# EAGLE board controller-r3 (EAGLE 6.6.0)
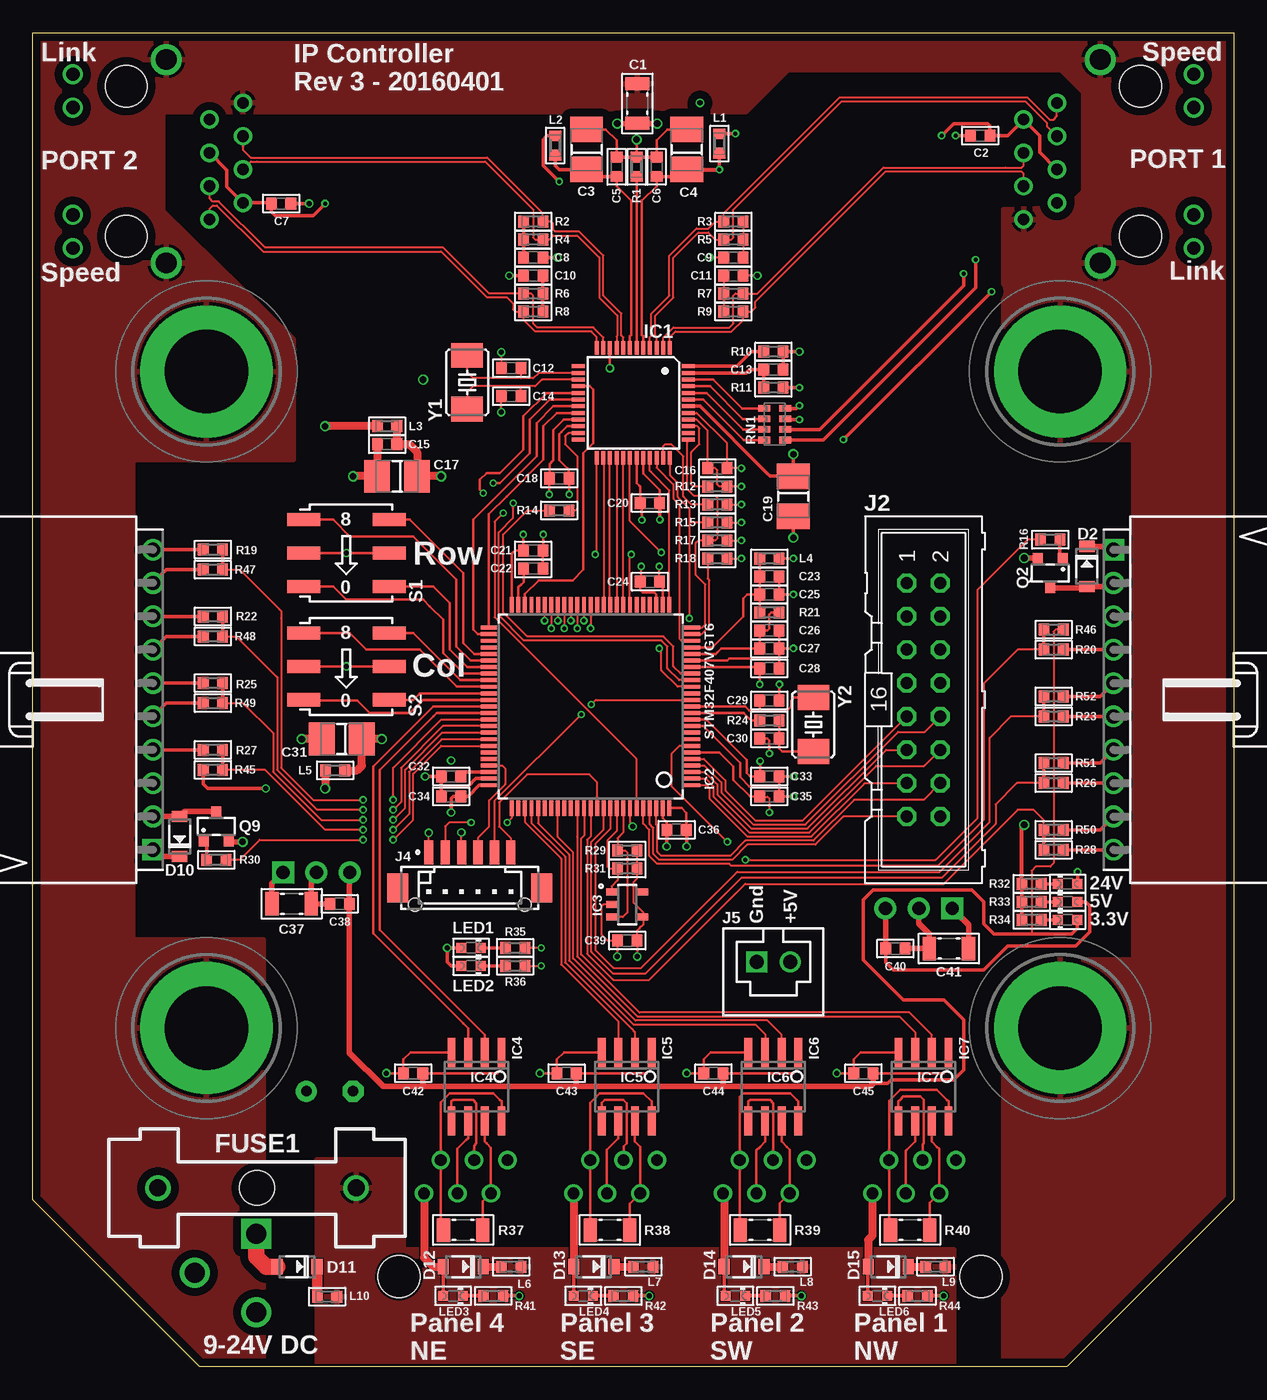
[diagram p3: board, top side]
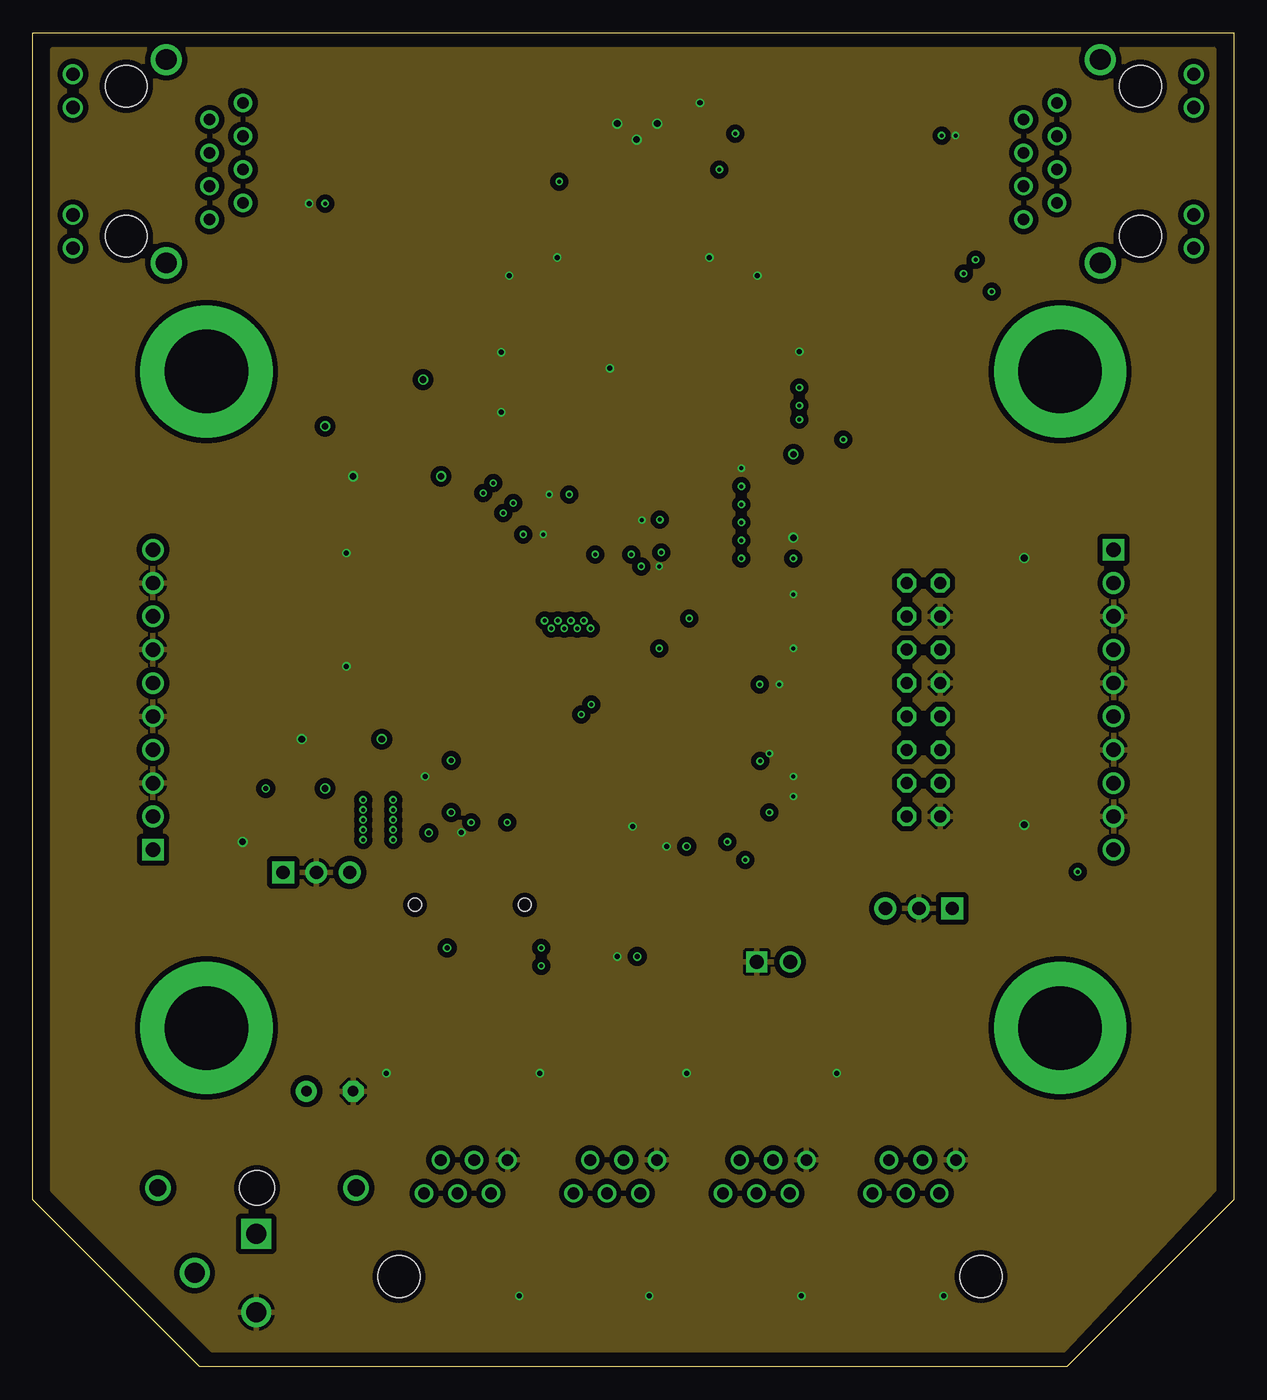
[diagram p4: board, inner layer Route2]
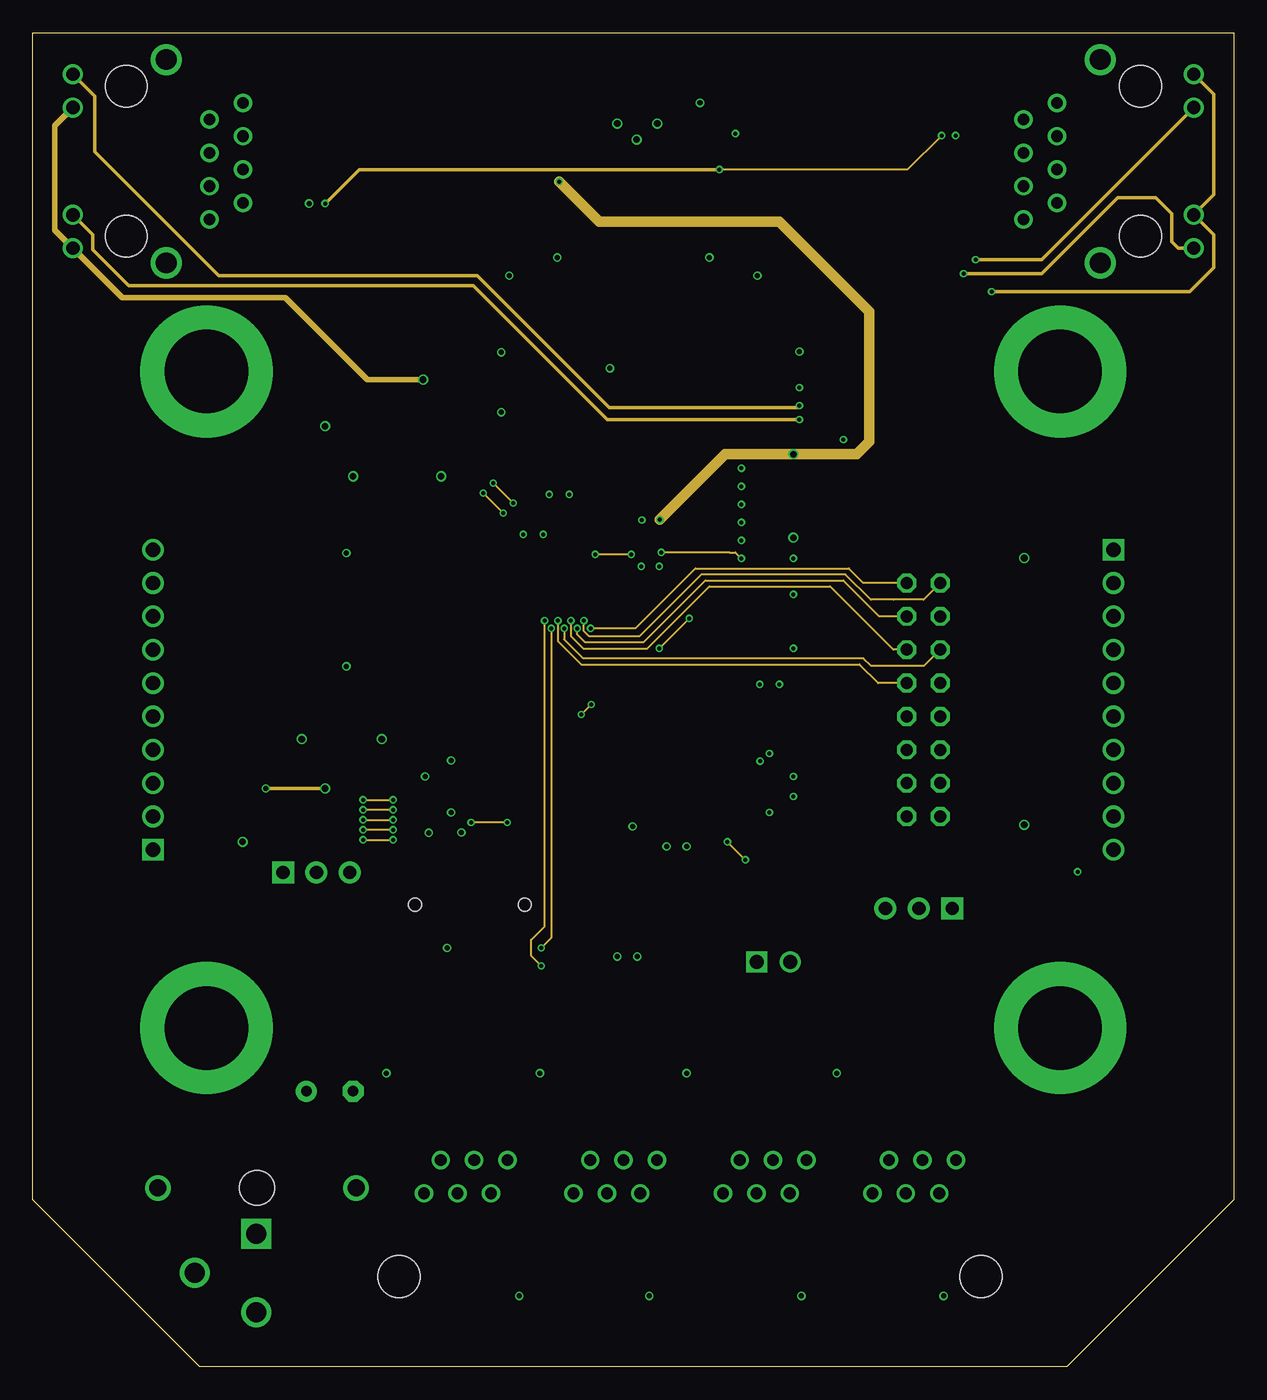
[diagram p5: board, inner layer Route3]
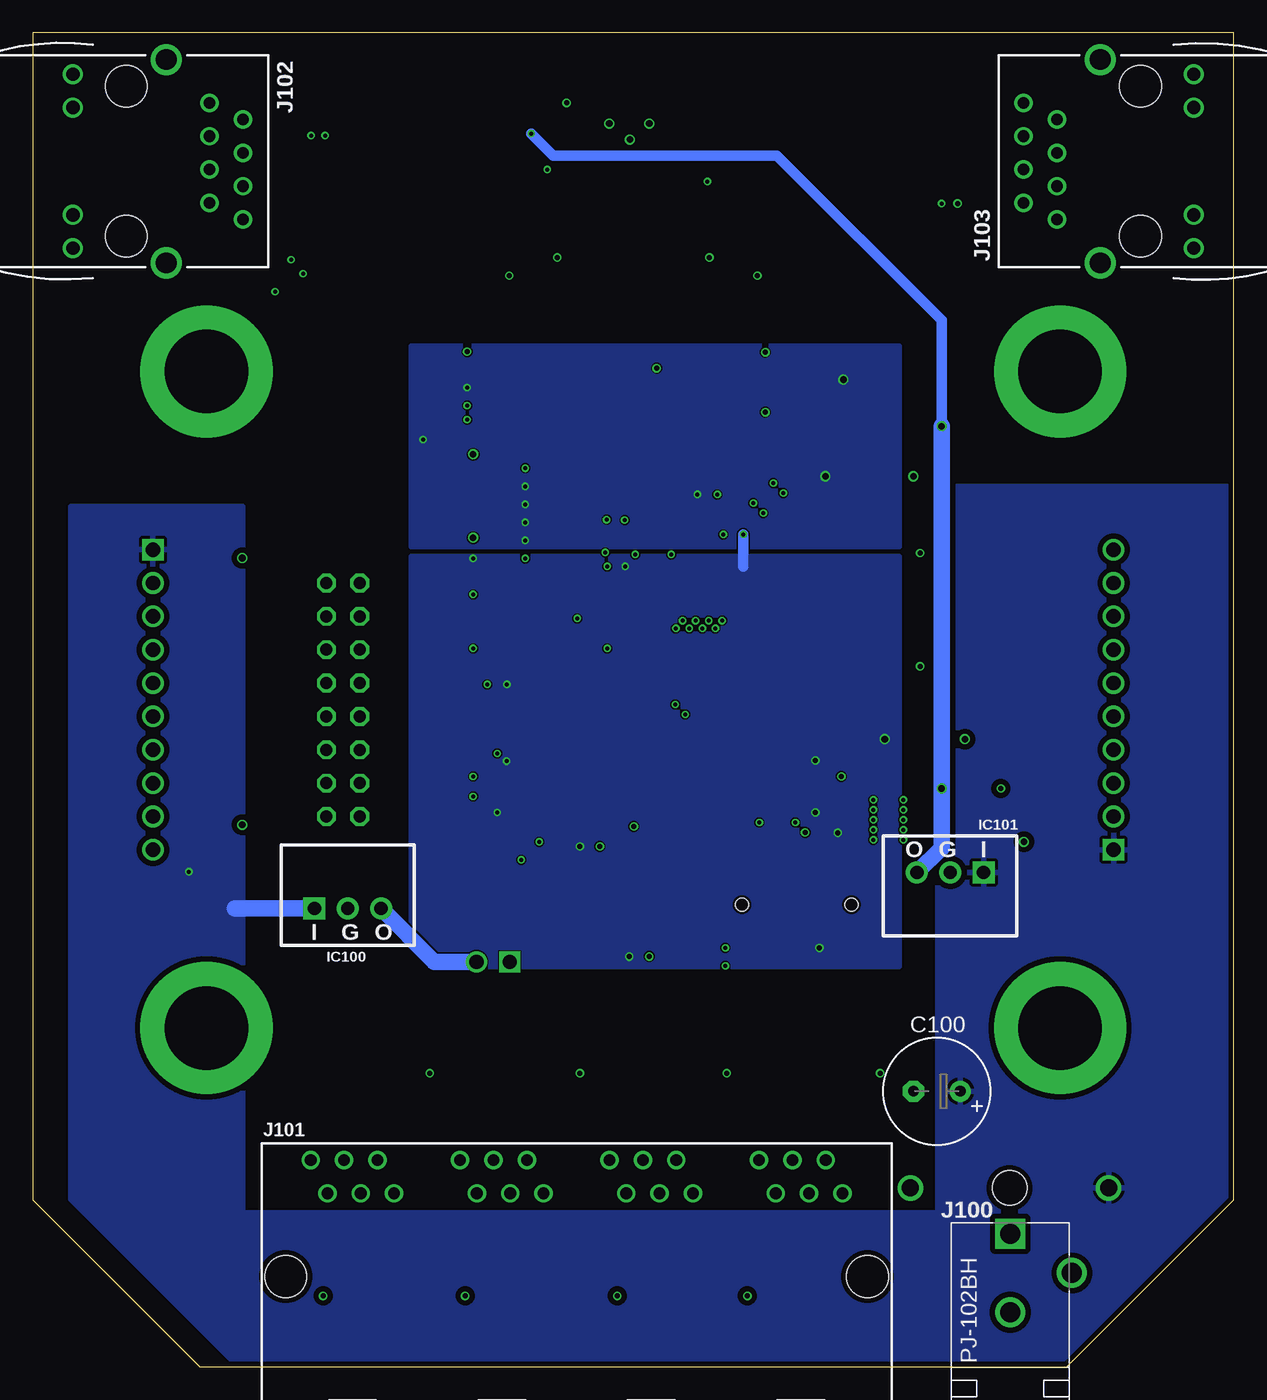
[diagram p6: board, bottom side, seen from below]

Size 91.44 x 101.6 mm. Coordinates in mm from the lower left corner, seen from the top.
Outline: 78.74,0 12.7,0 0,12.7 0,101.6 91.44,101.6 91.44,12.7 78.74,0
Copper layers (1+2*3+16): Top 0.042mm / dielectric 0.2mm / Route2 0.035mm / dielectric 1.1mm / Route3 0.035mm / dielectric 0.2mm / Bottom 0.042mm
Design rules "quickturnpcb.co.kr_4L": minimum track width 4mil, minimum drill 12mil, track to track 4mil, track to pad 4mil, pad to pad 4mil, via to via 4mil, smd to smd 0mil, copper to edge 8mil, drill to drill 8mil, minimum pad ring 10mil, minimum via ring 5mil, stop-mask expansion 2mil, vias tented up to drill 20mil, thermal gap 10mil
Net classes: 1 Earth: clearance 0.406 mm

## Footprints (pad centres in the part's own frame; a part is rotated, then mirrored left to right if it is on the bottom)
C1206B = smd 1 x 1.8: 1 -1.5,0; 2 1.5,0
C0603B = smd 0.813 x 0.914: 1 -0.737,0; 2 0.737,0
B/3528-21R = smd 1.95 x 2.5: + 1.525,0; - -1.525,0
E3,5-8 = drill 0.813 pad 1.6: + -1.778,0 | drill 0.813 pad 1.6 octagon: - 1.778,0
SOD-123 = smd 0.85 x 1.2: A 1.525,0; C -1.525,0
649 = drill 1.295: 1 -7.544,0; 2 7.544,0 | hole 2.642: 0,0
TQFP48 = smd 1.016 x 0.305: 1 -4.191,2.794; 2 -4.191,2.286; 3 -4.191,1.778; 4 -4.191,1.27; 5 -4.191,0.762; 6 -4.191,0.254; 7 -4.191,-0.254; 8 -4.191,-0.762; 9 -4.191,-1.27; 10 -4.191,-1.778; 11 -4.191,-2.286; 12 -4.191,-2.794; 25 4.191,-2.794; 26 4.191,-2.286; 27 4.191,-1.778; 28 4.191,-1.27; 29 4.191,-0.762; 30 4.191,-0.254; 31 4.191,0.254; 32 4.191,0.762; 33 4.191,1.27; 34 4.191,1.778; 35 4.191,2.286; 36 4.191,2.794 | smd 0.305 x 1.016: 13 -2.794,-4.191; 14 -2.286,-4.191; 15 -1.778,-4.191; 16 -1.27,-4.191; 17 -0.762,-4.191; 18 -0.254,-4.191; 19 0.254,-4.191; 20 0.762,-4.191; 21 1.27,-4.191; 22 1.778,-4.191; 23 2.286,-4.191; 24 2.794,-4.191; 37 2.794,4.191; 38 2.286,4.191; 39 1.778,4.191; 40 1.27,4.191; 41 0.762,4.191; 42 0.254,4.191; 43 -0.254,4.191; 44 -0.762,4.191; 45 -1.27,4.191; 46 -1.778,4.191; 47 -2.286,4.191; 48 -2.794,4.191
LQFP-100 = smd 0.3 x 1.2: 1 -6,-7.75; 2 -5.5,-7.75; 3 -5,-7.75; 4 -4.5,-7.75; 5 -4,-7.75; 6 -3.5,-7.75; 7 -3,-7.75; 8 -2.5,-7.75; 9 -2,-7.75; 10 -1.5,-7.75; 11 -1,-7.75; 12 -0.5,-7.75; 13 0,-7.75; 14 0.5,-7.75; 15 1,-7.75; 16 1.5,-7.75; 17 2,-7.75; 18 2.5,-7.75; 19 3,-7.75; 20 3.5,-7.75; 21 4,-7.75; 22 4.5,-7.75; 23 5,-7.75; 24 5.5,-7.75; 25 6,-7.75; 51 6,7.75; 52 5.5,7.75; 53 5,7.75; 54 4.5,7.75; 55 4,7.75; 56 3.5,7.75; 57 3,7.75; 58 2.5,7.75; 59 2,7.75; 60 1.5,7.75; 61 1,7.75; 62 0.5,7.75; 63 0,7.75; 64 -0.5,7.75; 65 -1,7.75; 66 -1.5,7.75; 67 -2,7.75; 68 -2.5,7.75; 69 -3,7.75; 70 -3.5,7.75; 71 -4,7.75; 72 -4.5,7.75; 73 -5,7.75; 74 -5.5,7.75; 75 -6,7.75 | smd 1.2 x 0.3: 26 7.75,-6; 27 7.75,-5.5; 28 7.75,-5; 29 7.75,-4.5; 30 7.75,-4; 31 7.75,-3.5; 32 7.75,-3; 33 7.75,-2.5; 34 7.75,-2; 35 7.75,-1.5; 36 7.75,-1; 37 7.75,-0.5; 38 7.75,0; 39 7.75,0.5; 40 7.75,1; 41 7.75,1.5; 42 7.75,2; 43 7.75,2.5; 44 7.75,3; 45 7.75,3.5; 46 7.75,4; 47 7.75,4.5; 48 7.75,5; 49 7.75,5.5; 50 7.75,6; 76 -7.75,6; 77 -7.75,5.5; 78 -7.75,5; 79 -7.75,4.5; 80 -7.75,4; 81 -7.75,3.5; 82 -7.75,3; 83 -7.75,2.5; 84 -7.75,2; 85 -7.75,1.5; 86 -7.75,1; 87 -7.75,0.5; 88 -7.75,0; 89 -7.75,-0.5; 90 -7.75,-1; 91 -7.75,-1.5; 92 -7.75,-2; 93 -7.75,-2.5; 94 -7.75,-3; 95 -7.75,-3.5; 96 -7.75,-4; 97 -7.75,-4.5; 98 -7.75,-5; 99 -7.75,-5.5; 100 -7.75,-6
SOT-23-5 = smd 0.55 x 0.8: 1 -0.95,-1.2; 2 0,-1.2; 3 0.95,-1.2; 4 0.95,1.2; 5 -0.95,1.2
SO08 = smd 0.6 x 2.2: 1 -1.905,-2.6; 2 -0.635,-2.6; 3 0.635,-2.6; 4 1.905,-2.6; 5 1.905,2.6; 6 0.635,2.6; 7 -0.635,2.6; 8 -1.905,2.6
OKI-78SR-V = drill 1.016 pad 1.676: GND 0,0; OUT 2.54,0 | drill 1.016 pad 1.676 square: IN -2.54,0
MOLEX_70553-(10) = drill 1.092 square: 1 11.43,0 | drill 1.092: 2 8.89,0; 3 6.35,0; 4 3.81,0; 5 1.27,0; 6 -1.27,0; 7 -3.81,0; 8 -6.35,0; 9 -8.89,0; 10 -11.43,0
ML16 = drill 0.914 octagon: 1 -8.89,-1.27; 2 -8.89,1.27; 3 -6.35,-1.27; 4 -6.35,1.27; 5 -3.81,-1.27; 6 -3.81,1.27; 7 -1.27,-1.27; 8 -1.27,1.27; 9 1.27,-1.27; 10 1.27,1.27; 11 3.81,-1.27; 12 3.81,1.27; 13 6.35,-1.27; 14 6.35,1.27; 15 8.89,-1.27; 16 8.89,1.27
DF13-6P-1.25V = smd 0.7 x 1.8: 1 -3.125,2.7; 2 -1.875,2.7; 3 -0.625,2.7; 4 0.625,2.7; 5 1.875,2.7; 6 3.125,2.7 | smd 1.6 x 2.2: T1 5.475,0; T2 -5.475,0 | hole 1: 4.18,-1.3; -4.18,-1.3
MOLEX_70543-0001 = drill 1.067 square: 1 -1.27,0 | drill 1.067: 2 1.27,0
PJ-102(DC_JACK) = drill 1.524 square: 1 0,13.691 | drill 1.524: 2 0,7.696; 3 4.699,10.693
SS-666604-NF = drill 0.889: A1 -20.244,8.89; A2 -18.974,6.35; A3 -17.704,8.89; A4 -16.434,6.35; A5 -15.164,8.89; A6 -13.894,6.35; B1 -8.865,8.89; B2 -7.595,6.35; B3 -6.325,8.89; B4 -5.055,6.35; B5 -3.785,8.89; B6 -2.515,6.35; C1 2.515,8.89; C2 3.785,6.35; C3 5.055,8.89; C4 6.325,6.35; C5 7.595,8.89; C6 8.865,6.35; D1 13.894,8.89; D2 15.164,6.35; D3 16.434,8.89; D4 17.704,6.35; D5 18.974,8.89; D6 20.244,6.35 | hole 3.2: -22.149,0; 22.149,0
SI-60062-F = drill 0.889: 1 -4.445,6.35; 2 -3.175,8.89; 3 -1.905,6.35; 4 -0.635,8.89; 5 0.635,6.35; 6 1.905,8.89; 7 3.175,6.35; 8 4.445,8.89 | drill 1.016: GA 4.089,-4.064; GC 6.629,-4.064; YA -6.629,-4.064; YC -4.089,-4.064 | drill 1.575: P$1 -7.747,3.048; P$2 7.747,3.048 | hole 3.2: -5.715,0; 5.715,0
R0603B = smd 0.813 x 0.914: 1 -0.737,0; 2 0.737,0
CHIPLED_0603 = smd 0.762 x 0.762: A 0,-0.737; C 0,0.737
SOT-23 = smd 0.762 x 0.762: 1 -1.143,0.953; 2 -1.143,-0.953; 3 1.143,0
R1206B = smd 1 x 1.8: 1 -1.5,0; 2 1.5,0
CTS_742-4 = smd 0.9 x 0.5: A1 -0.8,1.2; A2 0.8,1.2; B1 -0.8,0.4; B2 0.8,0.4; C1 -0.8,-0.4; C2 0.8,-0.4; D1 -0.8,-1.2; D2 0.8,-1.2
SH-7050TA = smd 2.5 x 1: 1 -3.25,2.54; 2 3.25,-2.54; 4 -3.25,-2.54; 8 3.25,2.54; C -3.25,0; C@2 3.25,0
SMTPR-6-1 = drill 6.35 pad 10.058: P$1 0,0
5X3.2 = smd 1.9 x 2.4: 1 -2.05,0; 2 2.05,0

## Placement (x,y rotation side)
C1  1000pF 2kV  [C1206B]  46.02,96.22 90 top
C2  10uF  [C0603B]  72.14,93.78 180 top
C3  22uF  [B/3528-21R]  42.16,92.71 270 top
C4  22uF  [B/3528-21R]  49.78,92.71 270 top
C5  .1uF  [C0603B]  44.45,91.39 270 top
C6  .1uF  [C0603B]  47.5,91.39 270 top
C7  10uF  [C0603B]  18.9,88.6 180 top
C8  .1uF  [C0603B]  38.1,84.48 0 top
C9  .1uF  [C0603B]  53.34,84.48 180 top
C10  .1uF  [C0603B]  38.1,83.11 0 top
C11  .1uF  [C0603B]  53.34,83.11 180 top
C12  18pF  [C0603B]  36.42,76.05 0 top
C13  10uF  [C0603B]  56.39,75.95 180 top
C14  18pF  [C0603B]  36.42,73.91 0 top
C15  .1uF  [C0603B]  26.97,70.26 0 top
C16  .1uF  [C0603B]  52.12,68.43 180 top
C17  22uF  [B/3528-21R]  27.74,67.82 0 top
C18  .1uF  [C0603B]  40.08,67.67 180 top
C19  22uF  [B/3528-21R]  57.91,66.29 90 top
C20  .1uF  [C0603B]  46.99,65.79 180 top
C21  .1uF  [C0603B]  38.1,62.18 180 top
C22  2.2uF  [C0603B]  38.1,60.81 180 top
C23  1uF  [C0603B]  56.08,60.2 0 top
C24  .1uF  [C0603B]  46.99,59.79 180 top
C25  .1uF  [C0603B]  56.08,58.83 0 top
C26  1uF  [C0603B]  56.08,56.08 0 top
C27  .1uF  [C0603B]  56.08,54.71 0 top
C28  .1uF  [C0603B]  56.08,53.19 0 top
C29  5pF  [C0603B]  56.08,50.75 180 top
C30  5pF  [C0603B]  56.08,47.85 180 top
C31  22uF  [B/3528-21R]  23.52,47.8 0 top
C32  2.2uF  [C0603B]  31.85,44.96 180 top
C33  .1uF  [C0603B]  56.08,44.96 0 top
C34  .1uF  [C0603B]  31.85,43.43 180 top
C35  .1uF  [C0603B]  56.08,43.43 0 top
C36  .1uF  [C0603B]  49.02,40.89 0 top
C37  10uF 50v  [C1206B]  19.71,35.26 0 top
C38  10uF  [C0603B]  23.37,35.26 0 top
C39  .1uF  [C0603B]  45.26,32.46 180 top
C40  10uF  [C0603B]  65.68,31.85 180 top
C41  10uF 50v  [C1206B]  69.75,31.85 180 top
C42  .1uF  [C0603B]  28.96,22.35 0 top
C43  .1uF  [C0603B]  40.64,22.35 0 top
C44  .1uF  [C0603B]  51.82,22.35 0 top
C45  .1uF  [C0603B]  63.25,22.35 0 top
C100  100uF  [E3,5-8]  22.61,20.98 180 bottom
D2  CDBM140-G  [SOD-123]  80.26,60.96 270 top
D10  CDBM140-G  [SOD-123]  11.18,40.39 90 top
D11  CDBM140-G  [SOD-123]  20.12,7.62 180 top
D12  CDBM140-G  [SOD-123]  32.77,7.62 180 top
D13  CDBM140-G  [SOD-123]  42.72,7.62 180 top
D14  CDBM140-G  [SOD-123]  54.15,7.62 180 top
D15  CDBM140-G  [SOD-123]  65.13,7.62 180 top
FUSE1  5x20  [649]  17.07,13.61 180 top
IC1  KSZ8863MLLI  [TQFP48]  45.72,73.41 270 top
IC2  STM32F407VGT6  [LQFP-100]  42.47,50.29 90 top
IC3  24AA02E48T-I/OT  [SOT-23-5]  45.26,35.2 270 top
IC4  LTC2863  [SO08]  33.78,21.34 180 top
IC5  LTC2863  [SO08]  45.21,21.34 180 top
IC6  LTC2863  [SO08]  56.39,21.34 180 top
IC7  LTC2863  [SO08]  67.82,21.34 180 top
IC100  OKI-78SR-5/1.5-W36-C  [OKI-78SR-V]  67.46,34.9 0 bottom
IC101  OKI-78SR-3.3/1.5-W36-C  [OKI-78SR-V]  21.59,37.64 180 bottom
J1  10X1_70553-0009  [MOLEX_70553-(10)]  9.14,50.8 270 top
J2  2x8 header  [ML16]  67.82,50.8 270 top
J3  10X1_70553-0009  [MOLEX_70553-(10)]  82.3,50.8 90 top
J4  STM32-SW-DF13V  [DF13-6P-1.25V]  33.27,36.47 0 top
J5  1X2_70543  [MOLEX_70543-0001]  56.39,30.84 0 top
J100  PJ-102AH  [PJ-102(DC_JACK)]  17.02,-3.56 0 bottom
J101  RJ12-QUAD  [SS-666604-NF]  50.04,6.86 0 bottom
J102  MAGJACK-SI-60062-F  [SI-60062-F]  84.33,91.82 270 bottom
J103  MAGJACK-SI-60062-F  [SI-60062-F]  7.11,91.82 90 bottom
L1  100R  [R0603B]  52.27,93.17 270 top
L2  100R  [R0603B]  39.78,93.01 90 top
L3  100R  [R0603B]  26.97,71.63 0 top
L4  100R  [R0603B]  56.08,61.57 0 top
L5  100R  [R0603B]  23.01,45.42 0 top
L6  1000 Ohm  [R0603B]  36.42,7.62 180 top
L7  1000 Ohm  [R0603B]  46.48,7.62 180 top
L8  1000 Ohm  [R0603B]  57.86,7.62 180 top
L9  1000 Ohm  [R0603B]  68.73,7.62 180 top
L10  1000 Ohm  [R0603B]  22.4,5.33 180 top
LED1  green  [CHIPLED_0603]  33.38,31.9 270 top
LED2  red  [CHIPLED_0603]  33.38,30.53 270 top
LED3  green  [CHIPLED_0603]  32,5.38 270 top
LED4  green  [CHIPLED_0603]  41.91,5.38 270 top
LED5  green  [CHIPLED_0603]  53.49,5.38 270 top
LED6  green  [CHIPLED_0603]  64.31,5.38 270 top
POWER  green  [CHIPLED_0603]  78.79,36.78 90 top
POWER1  green  [CHIPLED_0603]  78.79,35.41 90 top
POWER2  green  [CHIPLED_0603]  78.79,34.04 90 top
Q2  NFET-IRLML0060-SOT23  [SOT-23]  77.47,60.45 270 top
Q9  NFET-IRLML0060-SOT23  [SOT-23]  13.97,41.15 90 top
R1  12k1  [R0603B]  45.97,91.39 90 top
R2  49R9  [R0603B]  38.1,87.22 0 top
R3  49R9  [R0603B]  53.34,87.22 180 top
R4  49R9  [R0603B]  38.1,85.85 0 top
R5  49R9  [R0603B]  53.34,85.85 180 top
R6  49R9  [R0603B]  38.1,81.74 0 top
R7  49R9  [R0603B]  53.34,81.74 180 top
R8  49R9  [R0603B]  38.1,80.37 0 top
R9  49R9  [R0603B]  53.34,80.37 180 top
R10  1k  [R0603B]  56.39,77.32 180 top
R11  10k  [R0603B]  56.39,74.57 0 top
R12  4k75  [R0603B]  52.12,67.06 180 top
R13  4k75  [R0603B]  52.12,65.68 180 top
R14  33R2  [R0603B]  40.08,65.23 180 top
R15  4k75  [R0603B]  52.12,64.31 180 top
R16  1k  [R0603B]  77.47,62.99 0 top
R17  4k75  [R0603B]  52.12,62.94 180 top
R18  33R2  [R0603B]  52.12,61.57 180 top
R19  61k9  [R0603B]  13.72,62.23 180 top
R20  1k  [R0603B]  77.72,54.61 0 top
R21  47R5  [R0603B]  56.08,57.45 0 top
R22  61k9  [R0603B]  13.72,57.15 180 top
R23  61k9  [R0603B]  77.72,49.53 0 top
R24  0R  [R0603B]  56.08,49.23 180 top
R25  61k9  [R0603B]  13.72,52.07 180 top
R26  61k9  [R0603B]  77.72,44.45 0 top
R27  1k  [R0603B]  13.72,46.99 180 top
R28  61k9  [R0603B]  77.72,39.37 0 top
R29  4k75  [R0603B]  45.26,39.32 180 top
R30  1k  [R0603B]  13.97,38.61 180 top
R31  4k75  [R0603B]  45.26,37.95 180 top
R32  10k  [R0603B]  76.05,36.78 180 top
R33  1k1  [R0603B]  76.05,35.41 180 top
R34  475R  [R0603B]  76.05,34.04 180 top
R35  475R  [R0603B]  36.73,31.9 0 top
R36  475R  [R0603B]  36.73,30.53 0 top
R37  120R  [R1206B]  32.77,10.41 180 top
R38  120R  [R1206B]  43.94,10.41 180 top
R39  120R  [R1206B]  55.37,10.41 180 top
R40  120R  [R1206B]  66.8,10.41 180 top
R41  10k  [R0603B]  35.05,5.38 0 top
R42  10k  [R0603B]  44.96,5.38 0 top
R43  10k  [R0603B]  56.54,5.38 0 top
R44  10k  [R0603B]  67.36,5.38 0 top
R45  10k  [R0603B]  13.72,45.47 0 top
R46  10k  [R0603B]  77.72,56.13 0 top
R47  10k  [R0603B]  13.72,60.71 0 top
R48  10k  [R0603B]  13.72,55.63 0 top
R49  10k  [R0603B]  13.72,50.55 0 top
R50  10k  [R0603B]  77.72,40.89 0 top
R51  10k  [R0603B]  77.72,45.97 0 top
R52  10k  [R0603B]  77.72,51.05 0 top
RN1  220R  [CTS_742-4]  56.49,71.78 0 top
S1  SH-7050TA  [SH-7050TA]  23.88,61.98 180 top
S2  SH-7050TA  [SH-7050TA]  23.88,53.34 180 top
SCREW1  SCREW-632-0-PSHP  [SMTPR-6-1]  13.22,75.8 0 top
SCREW2  SCREW-632-0-PSHP  [SMTPR-6-1]  78.22,75.8 0 top
SCREW3  SCREW-632-0-PSHP  [SMTPR-6-1]  13.22,25.8 0 top
SCREW4  SCREW-632-0-PSHP  [SMTPR-6-1]  78.22,25.8 0 top
Y1  25MHz  [5X3.2]  33.07,74.98 90 top
Y2  20MHz  [5X3.2]  59.44,48.92 270 top

## Tracks (layer width: path | path; a pad name or v marks a point on that pad's centre or on a via)
3V3A  (via drill 0.3)
  Top 0.203: IC1.5 46.48,78.49 46.38,78.59 46.38,88.8 47.5,89.92 C6.2
  Top 0.254: C6.2 49.25,90.65 C4.+ | J103.5 14.78,91.13 14.78,89.86 J103.2 18.11,88.65 C7.2 18.16,87.96 18.44,87.68 21.34,87.68 v22.25,88.59 | v69.19,93.78 70.1,94.69 72.69,94.69 72.85,94.54 72.87,94.51 C2.1 74.22,93.78 J102.2 76.66,93.78 76.66,93.62 76.66,92.51 J102.5 | L1.2 v52.27,91.19
  Top 0.305: C4.+ v52.27,91.19
  Route3 0.152: v69.19,93.78 66.6,91.19 v52.27,91.19
  Route3 0.254: v22.25,88.59 24.84,91.19 v52.27,91.19
3V3D  (via drill 0.3, 0.51)
  Top 0.152: IC1.40 50.55,72.14 51.38,71.3 C16.2 51.97,68.43 52.12,68.28 52.12,67.21 52.27,67.06 R12.1 v53.95,67.06 | R13.1 v53.95,65.68 | R15.1 v53.95,64.31 | R17.1 v53.95,62.94
  Top 0.203: IC1.22 40.69,71.63 40.23,71.17 40.08,71.02 40.08,69.04 40.69,68.43 40.82,68.3 C18.1 40.84,67.64 v40.84,66.45
  Top 0.254: v58.37,74.57 R11.2 | v73,81.89 v61.72,70.61
  Top 0.61: L3.2 C15.2 28.65,70.26 29.26,69.65 C17.+ v31.09,67.82
  Route3 0.254: J102.YA 89.92,96.93 89.92,89.51 89.92,89.26 J102.GA 89.92,86.21 89.92,83.72 88.09,81.89 v73,81.89
  Route3 0.406: J103.GA 1.68,94.54 1.68,86.77 1.68,86.56 J103.YA 6.81,81.43 19.2,81.43 25.45,75.18 v29.72,75.18
  pour Bottom: 25.45,62.48 62.64,62.48 62.64,77.72 25.45,77.72
24V_MON_1  (via drill 0.3)
  Top 0.152: v25.15,41.66 21.95,41.66 18.29,45.31 18.29,48.26 16,50.55 R49.2 | v27.43,41.66 28.35,42.57 28.35,45.47 31.17,48.29 IC2.67
  Top 0.254: R25.1 R49.2
  Route3 0.152: v25.15,41.66 v27.43,41.66
24V_MON_2  (via drill 0.3)
  Top 0.152: IC2.66 31.21,48.79 28.04,45.62 28.04,43.03 v27.43,42.42 | v25.15,42.42 21.64,42.42 18.59,45.47 18.59,52.53 18.54,52.58 15.49,55.63 14.73,55.63 R48.2
  Top 0.254: R22.1 14.45,55.91 14.73,55.63
  Route3 0.152: v27.43,42.42 v25.15,42.42
24V_MON_3  (via drill 0.3)
  Top 0.152: v25.15,43.18 21.34,43.18 18.9,45.62 18.9,57 18.9,57.56 18.8,57.66 15.75,60.71 R47.2 | v27.43,43.18 27.43,45.62 31.11,49.29 IC2.65
  Top 0.254: R19.1 R47.2
  Route3 0.152: v25.15,43.18 v27.43,43.18
24V_MON_4
  Top 0.152: IC2.91 43.97,40.97 42.82,39.83 42.82,31.75 44.2,30.38 46.33,30.38 53.64,37.69 69.04,37.69 72.85,41.5 72.85,47.9 74.47,49.53 R23.1
  Top 0.254: R23.1 R52.1
24V_MON_5
  Top 0.152: IC2.90 43.47,40.93 42.52,39.98 42.52,31.6 44.2,29.92 46.63,29.92 53.95,37.24 69.19,37.24 73.3,41.35 73.3,42.82 74.93,44.45 R26.1
  Top 0.254: R51.1 R26.1
24V_MON_6
  Top 0.152: IC2.88 42.47,40.39 42.21,40.13 42.21,31.44 44.2,29.46 46.94,29.46 54.25,36.78 69.34,36.78 74.98,42.42 76.2,42.42 76.99,41.63 R50.1
  Top 0.254: R50.1 R28.1
!RST  (via drill 0.3)
  Top 0.152: v41.76,49.68 35.15,43.07 J4.5 | v42.52,50.44 42.87,50.79 IC2.14
  Route3 0.152: v41.76,49.68 v42.52,50.44
+3V3  (via drill 0.3, 0.38, 0.51)
  Top 0.152: R46.2 77.88,56.13 77.72,55.98 77.72,38.35 77.47,38.1 76.38,38.1 76.05,37.77 76.05,32.99 76.02,32.97
  Top 0.203: IC7.1 69.72,22.73 69.34,22.35 C45.2 | IC6.1 58.29,22.73 57.91,22.35 C44.2 | IC5.1 47.12,22.73 46.74,22.35 C43.2 | C42.2 35.36,22.35 35.69,22.68 IC4.1
  Top 0.254: L1.1 52.3,93.93 v53.49,93.93 | 63.98,21.56 65.1,21.56 65.38,21.84 70.1,21.84 70.87,22.61 70.87,26.42 69.34,27.94 66.29,27.94 63.25,30.99 63.25,35.56 64.01,36.32 71.48,36.32 72.39,35.41 72.39,33.73 73.15,32.97 76.02,32.97 79.1,32.97 79.53,33.4 POWER2.A | R45.1 12.98,44.4 13.34,44.04 v17.73,44.04
  Top 0.406: IC101.OUT 24.11,37.67 C38.2 24.11,23.9 26.67,21.34 29.72,21.34 | C45.2 63.98,21.56 63.75,21.34 58.42,21.34 57.91,21.34 53.34,21.34 52.58,21.34 | 52.58,21.34 41.4,21.34 | 41.4,21.34 29.72,21.34 | C44.2 52.55,21.36 52.58,21.34 | C43.2 41.38,21.36 41.4,21.34 | C42.2 29.69,21.36 29.72,21.34
  Top 0.61: L5.1 22.28,44.07 v22.25,44.04 | L3.1 v22.25,71.63
  Route3 0.254: v17.73,44.04 v22.25,44.04
  Bottom 0.813: v53.49,93.93 51.82,92.25 38.1,92.25 34.8,92.25 22.25,79.7 v22.25,71.63
  Bottom 1.27: v22.25,71.63 22.25,62.03 v22.25,44.04 22.25,39.52 IC101.OUT
+5V
  Top 0.254: C40.2 64.95,30.81 65.53,30.23 72.39,30.23 74.22,32.05 79.4,32.05 80.47,33.12 80.47,35.1 80.16,35.41 POWER1.A
  Top 0.406: C40.2 64.95,34.87 IC100.OUT
  Bottom 1.27: J5.2 60.86,30.84 IC100.OUT
+24V  (via drill 0.3)
  Top 0.254: POWER.A 79.55,36.8 v79.55,37.69
  Top 0.406: IC100.IN 71.02,33.88 71.25,33.65 C41.1 | J1.1 9.65,38.86 D10.C | J3.1 82.04,62.48 D2.C | IC101.IN 18.21,36.8 C37.1
  Bottom 1.27: IC100.IN 76.05,34.9
  pour Bottom (isolate 0.406): 0.15,67.06 22.56,67.06 22.56,11.73 75.44,11.73 75.44,65.53 88.54,65.53 88.54,12.8 75.9,0.15 12.8,0.15 0.15,12.8
AC_CTRL_1  (via drill 0.3)
  Top 0.152: v25.15,40.13 17.27,40.13 15.75,38.61 R30.1 | v27.43,40.13 28.96,41.66 28.96,45.16 31.09,47.29 IC2.69
  Route3 0.152: v25.15,40.13 v27.43,40.13
AC_CTRL_2  (via drill 0.3)
  Top 0.152: IC2.7 49.22,47.29 48.62,46.68 48.62,44.25 v52.88,39.98 | v54.25,38.61 68.73,38.61 71.93,41.81 71.93,59.18 75.74,62.99 R16.1
  Route3 0.152: v52.88,39.98 v54.25,38.61
AC_MON_1  (via drill 0.3)
  Top 0.152: IC2.68 31.13,47.79 28.65,45.31 28.65,42.11 v27.43,40.89 | v25.15,40.89 22.25,40.89 19.46,43.69 17.68,45.47 R45.2
  Top 0.254: R27.1 R45.2
  Route3 0.152: v27.43,40.89 v25.15,40.89
AC_MON_2
  Top 0.152: IC2.96 46.47,41.36 46.94,40.89 46.94,38.91 47.55,38.3 53.03,38.3 53.19,38.15 68.88,38.15 72.39,41.66 72.39,52.02 74.98,54.61 R20.1
  Top 0.254: R46.1 R20.1
CHASSIS
  pour Top (isolate 0.61): 91.34,101.4 0.15,101.4 0.2,12.85 12.8,0.15 17.53,0.2 17.53,32.51 7.62,32.51 7.62,69.09 19.81,69.09 19.81,78.23 9.91,87.99 9.91,95.61 54.25,95.61 57.45,98.81 78.33,98.81 80.01,97.13 80.01,89.51 78.79,88.29 73.91,88.14 73.91,70.61 83.82,70.61 83.82,30.99 73.91,30.99 73.91,0.2 78.64,0.2 91.29,12.7
CPU+  (via drill 0.3, 0.38, 0.51)
  Top 0.152: 55.37,43.41 55.96,43.41 56.08,43.28 v56.08,42.21 | C24.2 46.33,59.79 v46.33,60.96 | R29.1 R31.1 46,37.16 45.72,36.88 45.72,35.36 46.33,34.75 46.46,34.61 IC3.4 46.46,33.66 46.18,33.38 46,33.2 C39.1 46.02,32.44 v46.02,31.24 | J4.1 v30.15,40.66
  Top 0.203: IC2.28 47.47,58.8 47.32,58.95 46.46,58.95 46.25,59.16 C24.2 | IC2.100 49.41,42.54 49.76,42.19 C36.2 | IC2.11 51.29,49.29 54.36,46.23 54.36,45.21 54.61,44.96 C33.1 55.37,44.98 v55.37,46.13 | IC2.6 52.27,46.79 53.34,45.72 53.34,44.7 54.61,43.43 C35.1 55.37,43.41 | IC2.19 55.24,53.29 C28.1 v55.35,51.97 | v57.91,61.57 L4.2 | IC2.50 36.47,61.92 36.73,62.18 C21.2 37.34,62.2 v37.34,63.4
  Top 0.254: v31.85,42.21 31.85,43.28 32,43.43 C34.1 33.15,43.43 34,44.29 IC2.75 | C36.2 49.78,40.87 v49.78,39.62 | LED1.A v31.55,31.9 31.55,30.84 31.85,30.53 LED2.A
  Top 0.61: v26.57,47.8 C31.+ 25.04,45.77 24.69,45.41 L5.2
  Bottom 0.813: v37.34,63.4 37.34,60.96
  other vias: 31.85,46.18
  pour Bottom: 25.45,61.72 62.64,61.72 62.64,30.48 25.45,30.48
DISP_A
  Top 0.152: J2.9 58.62,41.6 55.02,41.6 52.73,43.89 52.73,44.65 51.09,46.29 IC2.5
DISP_B
  Top 0.152: J2.10 67.92,48.36 65.89,48.36 58.83,41.3 54.86,41.3 52.43,43.74 52.43,44.5 51.13,45.79 IC2.4
DISP_B0  (via drill 0.3)
  Top 0.152: IC2.40 41.45,58.03 v41.45,56.24
  Route3 0.152: v41.45,56.24 41.45,55.78 42.06,55.17 46.48,55.17 51.21,59.89 61.72,59.89 64.47,57.15 J2.3
DISP_B1  (via drill 0.3)
  Top 0.152: IC2.43 39.97,56.83 v39.98,56.82
  Route3 0.152: v39.98,56.82 39.98,55.27 41.76,53.49 62.94,53.49 64.36,52.07 J2.7
DISP_C
  Top 0.152: J2.11 64.97,46.99 58.98,41 54.71,41 52.12,43.59 52.12,44.35 51.18,45.29 IC2.3
DISP_CLK
  Top 0.152: IC2.1 51.26,44.29 51.51,44.04 51.51,43.28 54.41,40.39 59.28,40.39 63.3,44.4 63.35,44.45 J2.13
DISP_D
  Top 0.152: IC2.2 51.22,44.79 51.82,44.2 51.82,43.43 54.56,40.69 59.13,40.69 64.21,45.77 67.87,45.77 J2.12
DISP_G0  (via drill 0.3)
  Top 0.152: IC2.39 v41.96,56.82
  Route3 0.152: v41.96,56.82 41.96,56.03 42.37,55.63 46.18,55.63 50.9,60.35 61.87,60.35 63.8,58.42 65.53,58.42 67.82,58.42 J2.2
DISP_G1  (via drill 0.3)
  Top 0.152: IC2.42 v40.47,56.24 v40.46,56.24
  Route3 0.152: v40.46,56.24 40.46,55.4 41.91,53.95 63.25,53.95 63.8,53.39 67.36,53.39 67.87,53.39 J2.6
DISP_OE
  Top 0.152: J2.15 61.72,41.91 59.59,39.78 54.41,39.78 53.24,38.61 47.7,38.61 47.24,39.06 47.24,41.05 46.97,41.32 IC2.97
DISP_R0  (via drill 0.3)
  Top 0.152: IC2.38 v42.47,56.24
  Route3 0.152: v42.47,56.24 45.87,56.24 50.44,60.81 62.13,60.81 63.25,59.69 J2.1
DISP_R1  (via drill 0.3)
  Top 0.152: IC2.41 v40.97,56.82
  Route3 0.152: v40.97,56.82 40.97,55.65 41.91,54.71 46.79,54.71 51.51,59.44 60.71,59.44 65.53,54.61 J2.5
DISP_STB
  Top 0.152: J2.14 67.82,43.18 62.53,43.18 59.44,40.08 54.25,40.08 53.09,38.91 47.85,38.91 47.55,39.22 47.55,41.2 47.47,41.28 IC2.98
GND  (via drill 0.3, 0.38, 0.51)
  Top 0.152: IC1.41 50.55,72.64 52.86,70.33 C16.1 v53.95,68.43 | C24.1 47.7,59.79 v47.7,60.96 | IC3.2 43.43,35.2 43.28,35.05 43.28,32.92 43.74,32.46 C39.2 44.5,32.44 v44.5,31.24 | v35.66,77.27 35.66,76.07 C12.1 | v35.66,72.69 35.66,73.89 C14.1 | J4.3 32.64,39.18 v32.64,40.69 | IC2.94 45.47,41.35 v45.67,41.15 | v55.17,83.11 C11.1 | C9.2 v51.51,84.48
  Top 0.203: IC1.10 v43.94,76.05 | R1.2 v45.97,93.47 | IC2.20 52.89,53.79 53.05,53.95 56.84,53.95 | S2.C v23.88,53.34 S2.C@2 | S1.C v23.88,61.98 S1.C@2 | C3.- 43.64,94.23 44.45,93.42 C5.1 | C6.1 47.5,93.42 48.31,94.23 C4.- | IC7.4 63.05,23.94 62.51,23.39 C45.1 v61.21,22.35 | IC4.4 28.76,23.94 28.22,23.39 C42.1 v26.92,22.35 | IC5.4 40.45,23.94 39.9,23.39 C43.1 v38.61,22.35 | IC6.4 51.62,23.94 51.08,23.39 C44.1 v49.78,22.35 | C30.2 55.93,47.85 56.08,47.7 v56.08,46.71 | 56.84,44.93 C33.2 56.9,44.96 | 56.84,44.2 56.84,43.46 C35.2 v57.91,43.43 | 56.84,44.2 54.56,44.2 53.85,44.91 53.85,45.97 51.03,48.79 IC2.10 | v57.91,44.96 56.9,44.96 | 56.84,44.2 56.84,44.91 56.9,44.96 | 56.84,53.95 56.84,53.21 C28.2 | C27.2 56.84,54.69 56.84,53.95 | C26.2 C27.2 | C23.2 C25.2 v57.91,58.83 | C29.1 56.82,51.94 v56.84,51.97 | v57.91,54.71 C27.2 | v39.32,66.45 39.32,67.64 C18.2 39.34,68.76 39.62,69.04 39.62,71.32 40.44,72.14 IC1.21 | v38.86,63.4 38.86,62.2 C21.1 C22.1 | v46.38,64.49 46.38,65.66 C20.2 46.25,67.03 46.18,67.11 45.97,67.31 IC1.31 | IC2.27 47.97,59.55 C24.1 | 48.26,40.88 48.26,41.5 47.97,41.79 IC2.99
  Top 0.254: IC2.74 33.74,44.79 33.15,44.2 31.09,44.2 | 31.09,44.2 31.09,43.46 C34.2 | 31.09,44.2 31.09,44.93 C32.2 v29.87,44.96 | C6.1 R1.2 C5.1 | v21.03,88.59 C7.1 | C2.2 v70.26,93.78 | C19.- v57.91,63.14 | v58.37,77.32 R10.1 C13.1 | C10.1 v36.27,83.11 | C8.2 v39.93,84.48 | R34.2 R33.2 R32.2 | v48.26,39.62 48.26,40.87 C36.1 48.27,40.88 48.26,40.88 | R51.2 81.28,45.97 J3.7 | R52.2 81.28,51.05 J3.5 | R50.2 81.28,40.89 J3.9 | R47.1 10.16,60.71 J1.9 | R48.1 10.16,55.63 J1.7 | R49.1 10.16,50.55 J1.5
  Top 0.305: R32.2 75.31,41.1 v75.49,41.27 | v69.34,5.38 R44.2 | v58.52,5.38 R43.2 | v46.94,5.38 R42.2 | v37.03,5.38 R41.2
  Top 0.406: C40.1 C41.2 68.25,32.97 67.46,33.76 IC100.GND | C38.1 C37.2 21.21,37.26 IC101.GND | Q9.2 14.95,39.98 v15.98,39.98 | Q2.2 v75.49,61.59 | v44.5,94.69 45.87,94.69 46,94.69 | 46,94.69 v47.55,94.69 | C1.1 46,94.69
  Top 0.61: C31.- v20.47,47.8 | C15.1 26.24,67.84 C17.- v24.38,67.82
  other vias: 50.8,96.27
  pour Route2 (isolate 0.406, rank 6): 89.92,13.46 78.49,1.27 13.72,1.27 1.52,13.46 1.52,100.33 89.92,100.33
HEX1
  Top 0.203: 27.18,50.85 S2.1 28.96,50.8 29.45,51.29 IC2.61
HEX2
  Top 0.203: S2.2 24.13,55.88 25.4,54.61 29.46,54.61 32.28,51.79 IC2.60
HEX4
  Top 0.203: IC2.59 32.54,52.29 28.96,55.88 S2.4
HEX8
  Top 0.203: S2.8 20.57,50.75 24.69,50.75 25.65,49.78 28.7,49.78 29.71,50.79 IC2.62
HEX16
  Top 0.203: IC2.57 33.07,53.29 31.75,54.61 31.75,58.17 30.48,59.44 S1.1
HEX32
  Top 0.203: S1.2 22.86,64.52 24.13,63.25 28.96,63.25 32.26,59.94 32.26,54.86 33.33,53.79 IC2.56
HEX64
  Top 0.203: S1.4 28.7,64.52 32.77,60.45 32.77,55.12 33.59,54.29 IC2.55
HEX128
  Top 0.203: S1.8 22.86,59.44 23.88,58.42 29.72,58.42 30.23,57.91 31.24,56.9 31.24,54.36 32.81,52.79 IC2.58
I2C1_SCL
  Top 0.152: IC3.1 44.06,36.59 44.5,37.03 44.53,37.06 R31.2 43.89,37.95 43.74,38.1 43.74,40.08 44.47,40.81 IC2.92
I2C1_SDA
  Top 0.152: IC3.3 44.92,34.25 45.26,34.59 45.26,39.17 45.11,39.32 R29.2 44.53,40.26 44.65,40.39 44.97,40.7 IC2.93
MII_COL
  Top 0.152: IC2.26 48.47,66.75 47.09,68.12 46.99,68.22 IC1.33
MII_CRS
  Top 0.152: IC1.34 47.5,68.48 48.77,67.21 48.77,66.14 49.23,65.68 49.23,55.47 49.41,55.29 IC2.23
MII_MDC  (via drill 0.3)
  Top 0.152: IC2.16 49.1,51.79 47.85,53.03 47.85,54.56 v47.7,54.71 | IC1.36 48.51,67.92 49.07,67.36 49.07,66.29 49.68,65.68 49.99,65.38 49.99,64.31 | 49.99,64.31 v49.99,57 | R15.2 49.99,64.31
  Route3 0.152: v49.99,57 v47.7,54.71
MII_MDIO
  Top 0.152: IC2.25 50.96,56.29 51.21,56.54 51.21,59.59 50.44,60.35 50.44,62.69 50.7,62.94 R17.2 51.97,62.94 52.12,63.09 52.12,66.19 51.94,66.37 50.32,66.37 49.84,66.85 49.84,70.41 49.84,70.54 IC1.37
MII_RX_CLK
  Top 0.152: IC2.24 50.91,55.79 51.51,56.39 51.51,59.89 51.38,60.02 R18.2
MII_RX_DV  (via drill 0.3)
  Top 0.152: IC2.32 45.47,61.78 v45.57,61.87 | v42.82,61.87 42.93,61.98 IC1.25
  Route3 0.152: v45.57,61.87 v42.82,61.87
MII_RXD0
  Top 0.152: IC2.33 44.96,58.05 IC1.29
MII_RXD1
  Top 0.152: IC1.28 44.47,69.2 IC2.34
MII_RXD2
  Top 0.152: IC2.35 43.94,58.07 IC1.27
MII_RXD3
  Top 0.152: IC1.26 43.47,69.18 IC2.36
MII_TX_CLK
  Top 0.152: IC2.18 49.32,52.79 48.77,53.34 48.77,54.86 48.01,55.63 37.64,55.63 35.81,57.45 35.81,63.4 37.64,65.23 R14.2
MII_TX_EN
  Top 0.203: IC1.16 42.42,74.68 42.67,74.42 42.67,70.36 41.91,69.6 41.91,60.71 41.1,59.89 38.51,59.89 37.47,58.86 IC2.48
MII_TXD0
  Top 0.203: IC1.20 39.88,72.64 38.86,71.63 38.86,69.09 36.07,66.29 34.72,64.94 IC2.51
MII_TXD1
  Top 0.203: IC2.52 33.87,55.79 33.53,56.13 33.53,64.52 38.35,69.34 38.35,71.88 39.62,73.15 IC1.19
MII_TXD2  (via drill 0.3)
  Top 0.152: v36.58,65.79 36.58,64.67 35.46,63.55 35.46,57.25 37.39,55.32 47.85,55.32 48.31,54.86 48.31,53.19 49.21,52.29 IC2.17
  Top 0.203: IC1.18 39.37,73.66 37.85,72.14 37.85,69.6 35.56,67.31 v35.05,67.31
  Route3 0.203: v35.05,67.31 v36.58,65.79
MII_TXD3  (via drill 0.3)
  Top 0.152: v35.81,65.02 35.15,64.36 35.15,57.1 45.21,47.04 45.97,46.28 IC2.95
  Top 0.203: IC1.17 39.12,74.17 37.34,72.39 37.34,69.85 35.56,68.07 34.54,68.07 34.04,67.56 34.04,66.8 v34.29,66.55
  Route3 0.203: v34.29,66.55 v35.81,65.02
N$1
  Top 0.203: IC2.12 54.14,49.79 54.56,49.38 54.71,49.22 R24.2
N$2
  Top 0.203: IC2.13 54.25,50.29 54.56,49.99 55.32,49.99 | 55.32,49.99 57.45,49.99 57.76,50.29 57.76,50.75 57.98,50.97 Y2.1 | C29.2 55.35,50.01 55.32,49.99
N$3
  Top 0.203: R24.1 C30.1 56.82,47.12 56.84,47.09 57.07,46.87 Y2.2
N$4
  Top 0.203: IC2.49 36.97,59.37 37.19,59.59 37.36,59.77 C22.2
N$5
  Top 0.254: IC2.73 32.92,45.29 C32.1
N$6
  Top 0.203: L4.1 C23.1 C25.1 | C25.1 R21.1 | C25.1 54.41,58.83 54.1,58.52 54.1,57.15 51.82,54.86 51.74,54.79 IC2.22
N$7
  Top 0.203: R40.1 68.3,12.5 J101.A2 69.01,16.59 68.83,16.76 68.45,17.14 IC7.7
N$8
  Top 0.203: IC2.21 52.01,54.29 52.12,54.41 52.43,54.71 C27.1 C26.1 55.93,56.08 56.08,56.24 56.08,57.3 56.24,57.45 R21.2
N$9
  Top 0.152: C11.2 R7.2 R9.2
N$10
  Top 0.152: R3.1 R5.1 C9.1
N$11
  Top 0.254: C8.1 R4.1 R2.1
N$12
  Top 0.254: C10.2 R6.2 R8.2
N$13  (via drill 0.3)
  Top 0.152: R18.1 v53.95,61.57 | v47.85,62.03 45.47,64.41 IC1.30
  Route3 0.152: v47.85,62.03 53.03,62.03 53.49,62.03 v53.95,61.57
N$14
  Top 0.152: IC1.1 48.51,78.44 48.92,78.84 53.19,78.84 54.08,79.73 R9.1 54.71,80.37 55.02,80.67 55.02,81.13 59.89,86 64.92,91.03 75.29,91.03 75.44,90.88 J102.6
N$15
  Top 0.152: IC1.2 48.01,78.38 48.77,79.15 53.03,79.15 53.34,79.45 53.34,81.58 53.49,81.74 R7.1 55.17,81.74 59.74,86.31 64.77,91.34 74.07,91.34 75.29,91.34 75.44,91.49 J102.4
N$16
  Top 0.152: IC1.3 47.5,78.44 47.4,78.54 47.4,80.06 48.77,81.43 48.77,84.48 50.67,86.38 51.44,86.38 51.97,85.85 R5.2 53.19,85.85 53.34,86 53.34,88.14 53.8,88.59 60.5,95.3 61.57,96.37 75.59,96.37 77.22,94.74 77.22,94.49 J102.3
N$17
  Top 0.254: POWER1.C R33.1
N$18
  Top 0.152: IC1.8 44.96,78.38 44.81,78.54 44.81,80.21 43.43,81.58 43.43,84.63 41.6,86.46 40.23,86.46 39.78,86.46 39.62,86.61 39.62,87.07 39.47,87.22 R2.2 38.84,87.86 38.71,87.99 34.59,92.1 16.61,92.1 16,92.71 J103.6
N$19
  Top 0.152: IC1.9 44.45,78.49 44.5,78.54 44.5,80.06 43.13,81.43 43.13,84.48 41.45,86.16 39.62,86.16 39.32,85.85 R4.2 38.25,85.85 38.1,86 38.1,88.14 34.44,91.8 17.07,91.8 16.61,91.8 J103.4
N$20
  Top 0.152: IC1.11 43.43,78.38 42.67,79.15 38.41,79.15 38.1,79.45 38.1,81.58 37.95,81.74 R6.1 34.75,81.74 31.24,85.24 17.68,85.24 14.17,88.75 13.72,88.75 13.46,89 J103.3
N$21
  Top 0.152: IC1.12 42.93,78.44 42.52,78.84 38.25,78.84 37.36,79.73 R8.1 36.73,80.37 36.58,80.52 36.58,80.97 36.12,81.43 34.59,81.43 31.09,84.94 17.53,84.94 14.02,88.44 13.72,88.44 13.46,88.19 J103.1
N$22
  Top 0.203: R40.2 65.2,10.51 J101.A5 65.2,20.24 66.04,21.08 68.83,21.08 69.6,20.32 69.72,20.19 IC7.8
N$23
  Top 0.61: D15.C L9.2
N$24
  Top 0.254: POWER.C R32.1
N$25
  Top 0.203: J101.A3 67.74,16.94 67.82,17.02 67.82,20.32 67.56,20.57 66.29,20.57 66.04,20.32 65.91,20.19 IC7.5
N$26
  Top 0.152: IC1.23 40.79,71.12 40.54,70.87 40.54,70.26 41.45,69.34 41.45,65.38 41.3,65.23 R14.1
N$27
  Top 0.152: IC1.15 38.76,75.18 38.25,74.68 37.19,74.68 | 37.19,74.68 33.53,74.68 33.07,74.22 Y1.1 | C14.2 37.16,74.65 37.19,74.68
N$28
  Top 0.152: IC1.14 38.51,75.69 38.1,75.29 37.19,75.29 | 37.19,75.29 33.53,75.29 33.07,75.74 Y1.2 | C12.2 37.16,75.31 37.19,75.29
N$29
  Top 0.203: IC7.6 67.18,17.14 66.55,16.51 66.47,16.43 J101.A4
N$30
  Top 0.152: IC1.35 48.01,70.1 48.16,70.26 48.62,70.26 49.07,69.8 49.53,69.34 49.53,66.29 50.14,65.68 R13.2
N$31
  Top 0.254: IC1.47 54.3,75.69 54.56,75.95 C13.2 R11.1
N$32
  Top 0.203: R39.1 56.87,12.45 J101.B2 57.63,16.53 57.4,16.76 57.02,17.14 IC6.7
N$33
  Top 0.203: IC1.7 45.47,78.49 45.57,78.59 45.57,88.59 45.57,88.8 44.45,89.92 C5.2
  Top 0.254: C5.2 42.7,90.65 C3.+ 40.08,91.19 39.78,91.49 L2.1
N$34
  Top 0.254: IC1.48 53.59,76.2 54.71,77.32 R10.2
N$35
  Top 0.203: IC1.6 R1.1
N$36
  Top 0.203: IC6.8 58.29,20.19 58.17,20.32 57.66,20.83 54.1,20.83 53.82,20.55 J101.B5 53.82,10.46 R39.2
N$37
  Top 0.152: R12.2 50.29,67.06 50.14,67.21 50.14,69.65 50.75,70.26 50.75,71.48 50.6,71.63 IC1.39
N$38
  Top 0.254: D15.A 63.58,7.6 LED6.A
  Top 0.61: J101.A6 63.93,9.98 63.7,9.75 63.6,9.65 D15.A
N$39
  Top 0.203: J101.B3 56.36,17.25 56.39,17.27 56.39,20.07 56.13,20.32 54.61,20.32 54.48,20.19 IC6.5
N$40
  Top 0.203: IC6.6 55.75,17.14 55.37,16.76 55.09,16.48 J101.B4
N$41
  Top 0.203: IC5.7 45.85,17.14 46.25,16.74 J101.C2 45.44,12.4 R38.1
N$42
  Top 0.152: IC1.4 46.99,78.44 47.09,78.54 47.09,80.21 48.46,81.58 48.46,84.63 50.52,86.69 51.44,86.69 51.97,87.22 R3.2 52.6,87.86 53.34,88.59 60.35,95.61 61.42,96.67 75.74,96.67 77.42,95 77.72,95 77.98,95.25 J102.1
N$43
  Top 0.203: IC5.8 47.12,20.19 46.48,20.83 43.18,20.83 42.44,20.09 J101.C5 R38.2
N$44
  Top 0.61: D14.C L8.2
N$45
  Top 0.203: J101.C3 44.98,16.79 45.21,17.02 45.21,20.07 44.96,20.32 43.54,20.32 43.31,20.09 IC5.5
N$46
  Top 0.203: J101.C4 43.71,16.53 44.58,17.4 IC5.6
N$47
  Top 0.203: IC4.7 34.42,17.14 34.54,17.02 34.87,16.69 J101.D2 34.27,12.6 R37.1
N$48
  Top 0.203: IC4.8 35.69,20.19 35.56,20.32 35.05,20.83 31.75,20.83 31.06,20.14 J101.D5 31.06,10.62 R37.2
N$49
  Top 0.254: D14.A 52.63,5.51 LED5.A
  Top 0.61: J101.B6 52.63,13.13 D14.A
N$50
  Top 0.203: J101.D3 33.6,16.84 33.78,17.02 33.78,20.07 33.53,20.32 32,20.32 31.88,20.19 IC4.5
N$51
  Top 0.203: J101.D4 32.33,16.59 33.02,17.27 33.15,17.4 IC4.6
N$52
  Top 0.254: R27.2 J1.4
N$53
  Top 0.254: J1.10 R19.2
N$54
  Top 0.254: R22.2 J1.8
N$55
  Top 0.254: R25.2 J1.6
N$60
  Top 0.406: J1.2 D10.A 11.56,42.29 Q9.3
N$61
  Top 0.254: Q9.1 13.23,39.79 R30.2
N$62
  Top 0.61: D13.C L7.2
N$63
  Top 0.254: D13.A 41.2,5.41 LED4.A
  Top 0.61: J101.C6 41.2,13.18 D13.A
N$64
  Top 0.61: D12.C L6.2
N$65
  Top 0.254: D12.A 31.24,5.41 LED3.A
  Top 0.61: J101.D6 29.79,8.31 30.48,7.62 D12.A
N$66
  Top 0.813: D11.C 21.67,7.6 L10.2
N$67
  Top 1.27: J100.1 17.02,8.38 17.78,7.62 D11.A
N$68
  Top 0.254: J3.10 R28.2
N$70
  Top 0.254: R26.2 J3.8
N$72
  Top 0.254: J3.6 R23.2
N$74
  Top 0.254: R20.2 J3.4
N$76
  Top 0.406: J3.2 82.04,59.43 D2.A 80.14,59.31 Q2.3
N$77
  Top 0.254: Q2.1 78.21,61.81 R16.2
N$78
  Top 0.254: POWER2.C R34.1
N$79
  Top 0.254: LED1.C R35.1
N$80
  pour Top: 21.64,15.75 28.19,15.75 28.19,8.89 70.1,8.89 70.1,0.2 21.64,0.2
N$81
  Top 0.254: LED2.C R36.1
N$82  (via drill 0.3)
  Top 0.152: R36.2 v38.71,30.53 | v38.96,56.82 v38.97,56.82 IC2.45
  Route3 0.152: v38.71,30.53 37.95,31.29 37.95,32.51 38.96,33.53 v38.96,56.82
N$83  (via drill 0.3)
  Top 0.152: IC2.44 v39.47,56.24 | v38.71,31.9 R35.2
  Route3 0.152: v39.47,56.24 39.47,32.66 v38.71,31.9
N$84
  Top 0.305: R43.1 LED5.C
N$85
  Top 0.305: R44.1 LED6.C
N$86
  Top 0.305: R42.1 LED4.C
N$87
  Top 0.305: R41.1 LED3.C
P1_LINK  (via drill 0.3)
  Top 0.254: RN1.C2 59.9,71.38 70.87,82.35 v70.87,83.26
  Route3 0.254: v70.87,83.26 76.81,83.26 82.6,89.05 85.5,89.05 86.72,87.83 86.72,85.7 87.22,85.19 J102.GC
P1_SPEED  (via drill 0.3)
  Top 0.254: v71.78,84.33 71.78,82.19 60.17,70.58 RN1.D2
  Route3 0.254: J102.YC 76.81,84.33 v71.78,84.33
P1L
  Top 0.203: IC1.44 51.31,74.17 54.1,71.38 RN1.C1
P1S
  Top 0.203: IC1.43 51.05,73.66 54.13,70.58 RN1.D1
P2_LINK  (via drill 0.3)
  Top 0.254: v58.37,73.2 58.15,72.98 RN1.A2
  Route3 0.254: J103.GC 4.72,96.77 4.72,94.84 4.72,92.56 14.17,83.11 33.83,83.11 43.89,73.05 58.22,73.05 v58.37,73.2
P2_SPEED  (via drill 0.3)
  Top 0.254: RN1.B2 57.33,72.14 v58.37,72.14
  Route3 0.254: v58.37,72.14 43.74,72.14 33.53,82.35 11.89,82.35 11.58,82.35 7.31,82.35 4.57,85.09 4.57,86.21 J103.YC
P2L
  Top 0.203: IC1.46 51.82,75.18 54.02,72.98 RN1.A1
P2S
  Top 0.203: IC1.45 51.56,74.68 54.06,72.18 RN1.B1
RX2
  Top 0.152: IC7.2 68.45,25.27 66.75,26.97 46.18,26.97 41.76,31.39 41.76,40.23 41.97,40.44 IC2.87
RX4
  Top 0.152: IC2.79 37.97,41.43 40.54,38.86 40.54,30.78 45.57,25.76 45.85,25.48 IC5.2
RX5
  Top 0.152: IC6.2 57.02,25.27 55.93,26.36 45.87,26.36 41.15,31.09 41.15,39.17 39.97,40.35 IC2.83
RX6
  Top 0.203: IC4.2 34.42,25.27 26.42,33.27 26.42,45.47 30.48,49.53 30.74,49.79 IC2.64
SWCLK  (via drill 0.3)
  Top 0.152: IC2.76 36.47,41.8 v36.12,41.45 | v33.38,41.45 31.7,41.45 31.4,41.15 J4.2
  Route3 0.152: v36.12,41.45 v33.38,41.45
SWDIO
  Top 0.152: IC2.72 35.74,45.79 35.97,45.57 35.97,44.35 34.75,43.13 34.75,41.15 33.9,40.3 J4.4
TRACESWO
  Top 0.152: IC2.89 42.97,44.51 42.37,45.11 37.64,45.11 35.51,42.98 35.51,41.15 36.4,40.26 J4.6
TX2
  Top 0.152: IC2.86 41.47,40.4 41.45,40.39 41.45,31.24 46.02,26.67 65.99,26.67 67.18,25.48 IC7.3
TX4
  Top 0.152: IC2.78 37.47,41.47 40.23,38.71 40.23,30.63 44.58,26.29 IC5.3
TX5
  Top 0.152: IC2.80 38.47,41.39 40.84,39.01 40.84,30.94 45.72,26.06 55.02,26.06 55.75,25.32 IC6.3
TX6
  Top 0.203: IC2.63 30.48,50.29 25.91,45.72 25.91,33.02 32.77,26.16 33.15,25.78 IC4.3
VDDC  (via drill 0.3, 0.51)
  Top 0.203: C20.1 47.73,66.78 46.48,68.02 IC1.32
  Top 0.254: L2.2 39.14,93.75 38.86,93.47 38.86,91.49 v40.08,90.27 | IC1.42 50.8,73.15 55.93,68.02 56.13,67.82 C19.+ v57.91,69.49 | v47.75,64.52 47.75,65.76 C20.1
  Route3 0.813: v40.08,90.27 43.13,87.22 56.84,87.22 63.7,80.37 63.7,70.46 62.74,69.49 v57.91,69.49 52.73,69.49 v47.75,64.52

## Text on the board
tPlace: Link | Speed | IP Controller / Rev 3 - 20160401 | PORT 1 | PORT 2 | Link | Speed | Row | Col | 24V | 5V | Gnd | +5V | 3.3V | 9-24V DC | Panel 4 / NE | Panel 3 / SE | Panel 2 / SW | Panel 1 / NW
Measures: Height .670" | Height 9.3mm | 4x #6 screw
Reference: ---Board Specifications--- / 4-layer 1oz copper, ENIG finish / Black soldermask, white silkscreen
_tPlace: C10 | C3
_bPlace: R100 | R101 | R102 | R103 | R104
_tNames: C45 | C44 | L6 | C42 | C43 | C41 | R21 | C40 | R22 | C39 | R20 | R19 | R18 | C35 | C36 | C38 | IC11 | C37 | R13 | R17 | R16 | R15 | R14 | R12 | C33 | C34 | C30 | L5 | C32 | RN1 | C29 | C27 | Y2 | L4 | C31 | C28 | R10 | R11 | R9 | C26 | R7 | R8 | C25 | C24 | C23 | C20 | C21 | L3 | C22 | R6 | IC10 | R5 | C19 | C18 | IC7 | C17 | Y1 | IC9 | C14 | C16 | C13 | C15 | C11 | C10 | C9 | R4 | C12 | IC8 | IC6 | C8 | RA2 | R2 | R3 | IC5 | C6 | J1 | C7 | RA1 | L2 | IC3 | IC4 | C5 | C4 | C3 | IC2 | IC1 | C2 | C1 | PL1 | L1 | R1
_bNames: R100 | R101 | R102 | R103 | R104 | LED100
_tDocu: J2